# EAGLE schematic GadgetsP2 (EAGLE 6.5.0)
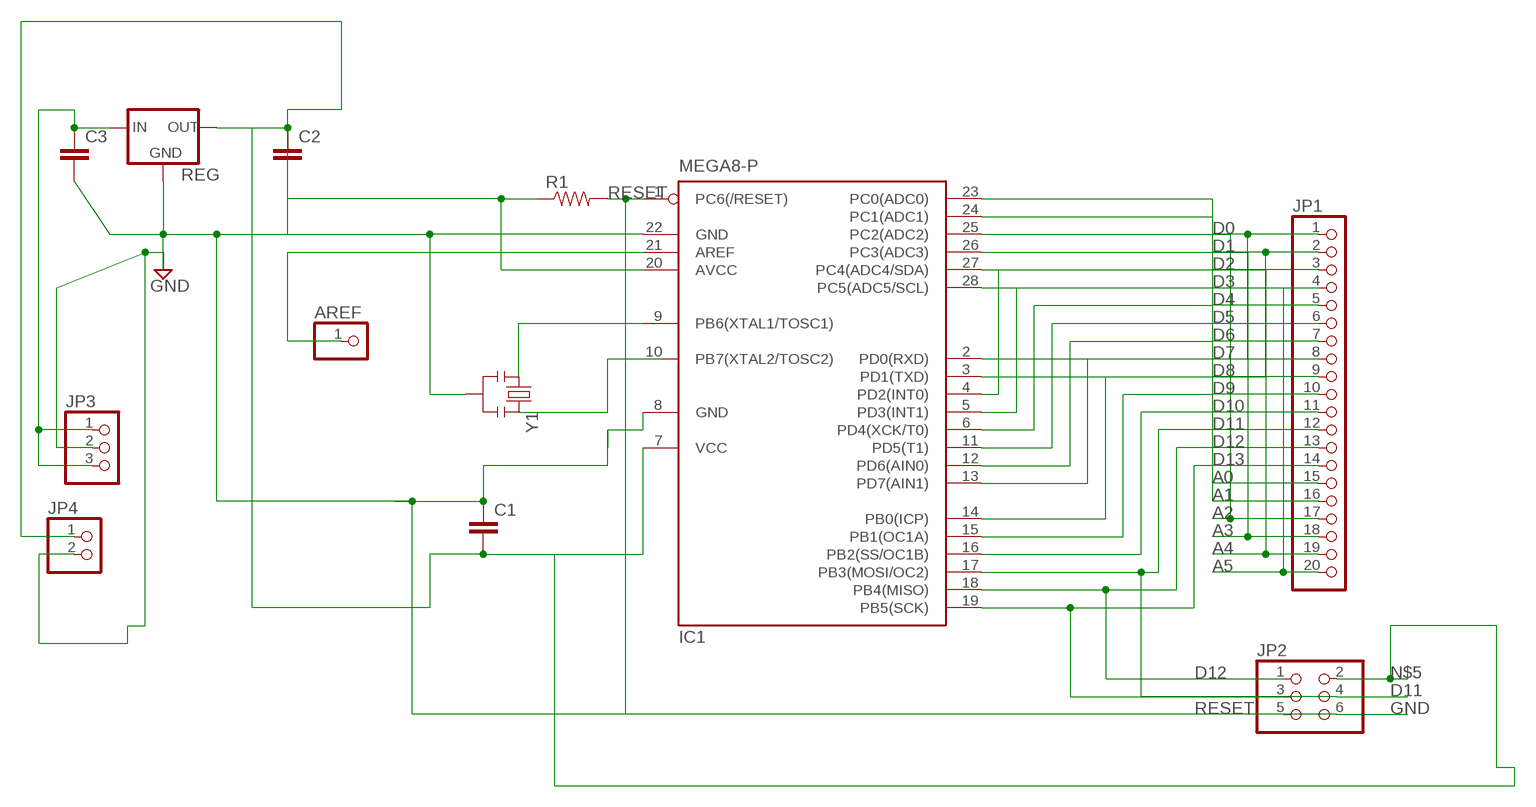
[diagram p0: schematic, sheet 1]

## Parts
AREF  PINHD-1X1  [1X01]
C1  C5/2.5  [C5B2.5]
C2  C5/2.5  [C5B2.5]
C3  C5/2.5  [C5B2.5]
IC1  MEGA8-P  [DIL28-3]
JP1  PINHD-1X20  [1X20]
JP2  PINHD-2X3  [2X03]
JP3  PINHD-1X3  [1X03]
JP4  PINHD-1X2  [1X02]
R1  RESISTORPTH-1/6W  [1/6W-RES]
REG  V_REG_78XXSIDE  [78XXL]
Y1  RESONATORPTH  [RESONATOR-PTH]

## Nets
A0: IC1.23(PC0(ADC0)) JP1.15
A1: IC1.24(PC1(ADC1)) JP1.16
A2: IC1.25(PC2(ADC2)) JP1.17
A3: IC1.26(PC3(ADC3)) JP1.18
A4: IC1.27(PC4(ADC4/SDA)) JP1.19
A5: IC1.28(PC5(ADC5/SCL)) JP1.20
D0: IC1.2(PD0(RXD)) JP1.1
D1: IC1.3(PD1(TXD)) JP1.2
D2: IC1.4(PD2(INT0)) JP1.3
D3: IC1.5(PD3(INT1)) JP1.4
D4: IC1.6(PD4(XCK/T0)) JP1.5
D5: IC1.11(PD5(T1)) JP1.6
D6: IC1.12(PD6(AIN0)) JP1.7
D7: IC1.13(PD7(AIN1)) JP1.8
D8: IC1.14(PB0(ICP)) JP1.9
D9: IC1.15(PB1(OC1A)) JP1.10
D10: IC1.16(PB2(SS/OC1B)) JP1.11
D11: IC1.17(PB3(MOSI/OC2)) JP1.12 JP2.4
D12: IC1.18(PB4(MISO)) JP1.13 JP2.1
D13: IC1.19(PB5(SCK)) JP1.14 JP2.3
GND: C1.1 C2.2 C3.2 IC1.8(GND) IC1.22(GND) JP2.6 JP3.2 JP4.2 REG.GND Y1.2
N$1: IC1.9(PB6(XTAL1/TOSC1)) Y1.1
N$2: Y1.3
N$3: AREF.1 IC1.21(AREF)
N$4: C3.1 JP3.1 JP3.3 REG.IN
N$5: C1.2 C2.1 IC1.7(VCC) IC1.20(AVCC) JP2.2 JP4.1 R1.1 REG.OUT
RESET: IC1.1(PC6(/RESET)) JP2.5 R1.2
Unconnected: IC1.10(PB7(XTAL2/TOSC2))

## Library data of the parts
AREF = pinhead:PINHD-1X1: PIN HEADER
C1-C3 = capacitor-wima:C: CAPACITOR naming: grid - package width
IC1 = atmel:MEGA8-P: MICROCONTROLLER 8 Kbytes FLASH, 1 kbytes SRAM, 512 bytes EEPROM, USART, 4-channel 10 bit ADC, 2-channel 8 bit ADC Pin compatible with Atmega48, ATMega88, ATMega168 Source: avr.lbr; OC_FARNELL: unknown; OC_NEWARK: unknown
JP1 = pinhead:PINHD-1X20: PIN HEADER
JP2 = pinhead:PINHD-2X3: PIN HEADER
JP3 = pinhead:PINHD-1X3: PIN HEADER
JP4 = pinhead:PINHD-1X2: PIN HEADER
R1 = SparkFun-Resistors:RESISTOR: Resistor Basic schematic elements and footprints for 0603, 1206, and PTH resistors.
REG = SparkFun-PowerIC:V_REG_78XX: Voltage Regulator Standard 7805 5V regulator. IGO (Input Ground Output). Spark Fun Electronics SKU : COM-00107
Y1 = SparkFun-FreqCtrl:RESONATOR: Resonator Small SMD resonator. Used, eg, on the Arduino Pro/ Pro Mini boards. 8MHz- XTAL-08895 16MHz- XTAL-08900